# Altium schematic sheet USB.SchDoc
size A; SheetNumber: 7; SheetTotal: 12
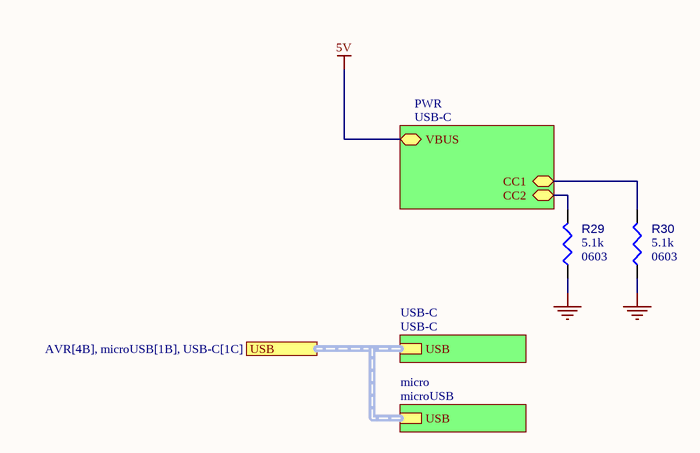
[diagram p0: USB.SchDoc]

## Parts
R29  value 5.1k  Case/Package: 0603  [RESC1608X55X25ML10T15]  (hidden comment: Resistor 1k +/-1% 0603 100 mW)
R30  value 5.1k  Case/Package: 0603  [RESC1608X55X25ML10T15]  (hidden comment: Resistor 1k +/-1% 0603 100 mW)

## Sub-sheets
micro = microUSB: USB (harness USB)
PWR = USB-C: VBUS (bidir), CC1 (bidir), CC2 (bidir)
USB-C = USB-C: USB (harness USB)

## Ports
USB (harness USB, see AVR[4B], microUSB[1B], USB-C[1C])

## Nets
5V: sheet PWR/VBUS
GND: R29.1 R30.1
NetR29_2: R29.2 ; sheet PWR/CC2
NetR30_2: R30.2 ; sheet PWR/CC1

## Buses and harness runs
harness port USB = sheet micro/USB = sheet USB-C/USB

## Library data of the parts
R29 R30 = CMP-009-00014-5: Chip Resistor, 1 KOhm, +/-1%, 0.1 W, -55 to 155 degC, 0603 (1608 Metric); Voltage Rating: 50V; Power: 100mW; Tolerance: 1%; Mounting Technology: SM; Pins: 2; Min Operating Temperature: -55°C; RoHS Compliant: True; Max Operating Temperature: 155°C